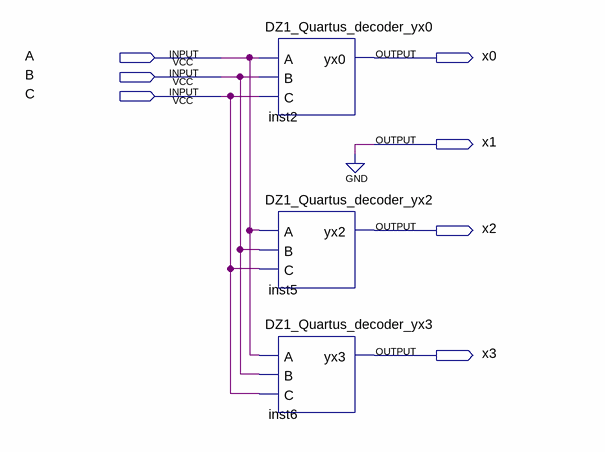
[diagram p0: schematic sheet]
// Quartus schematic DZ1_Quartus_decoder_main.bdf as structural Verilog: 3 symbols, 7 pins
module DZ1_Quartus_decoder_main (
  input  A,
  input  B,
  input  C,
  output x0,
  output x1,
  output x2,
  output x3
);

  DZ1_Quartus_decoder_yx0 inst2 (.A(A), .B(B), .C(C), .yx0(x0));
  DZ1_Quartus_decoder_yx2 inst5 (.A(A), .B(B), .C(C), .yx2(x2));
  DZ1_Quartus_decoder_yx3 inst6 (.A(A), .B(B), .C(C), .yx3(x3));

  assign x1 = 1'b0;
endmodule
